# EAGLE design I2C-Codeline-Matrix (EAGLE 7.7.0)
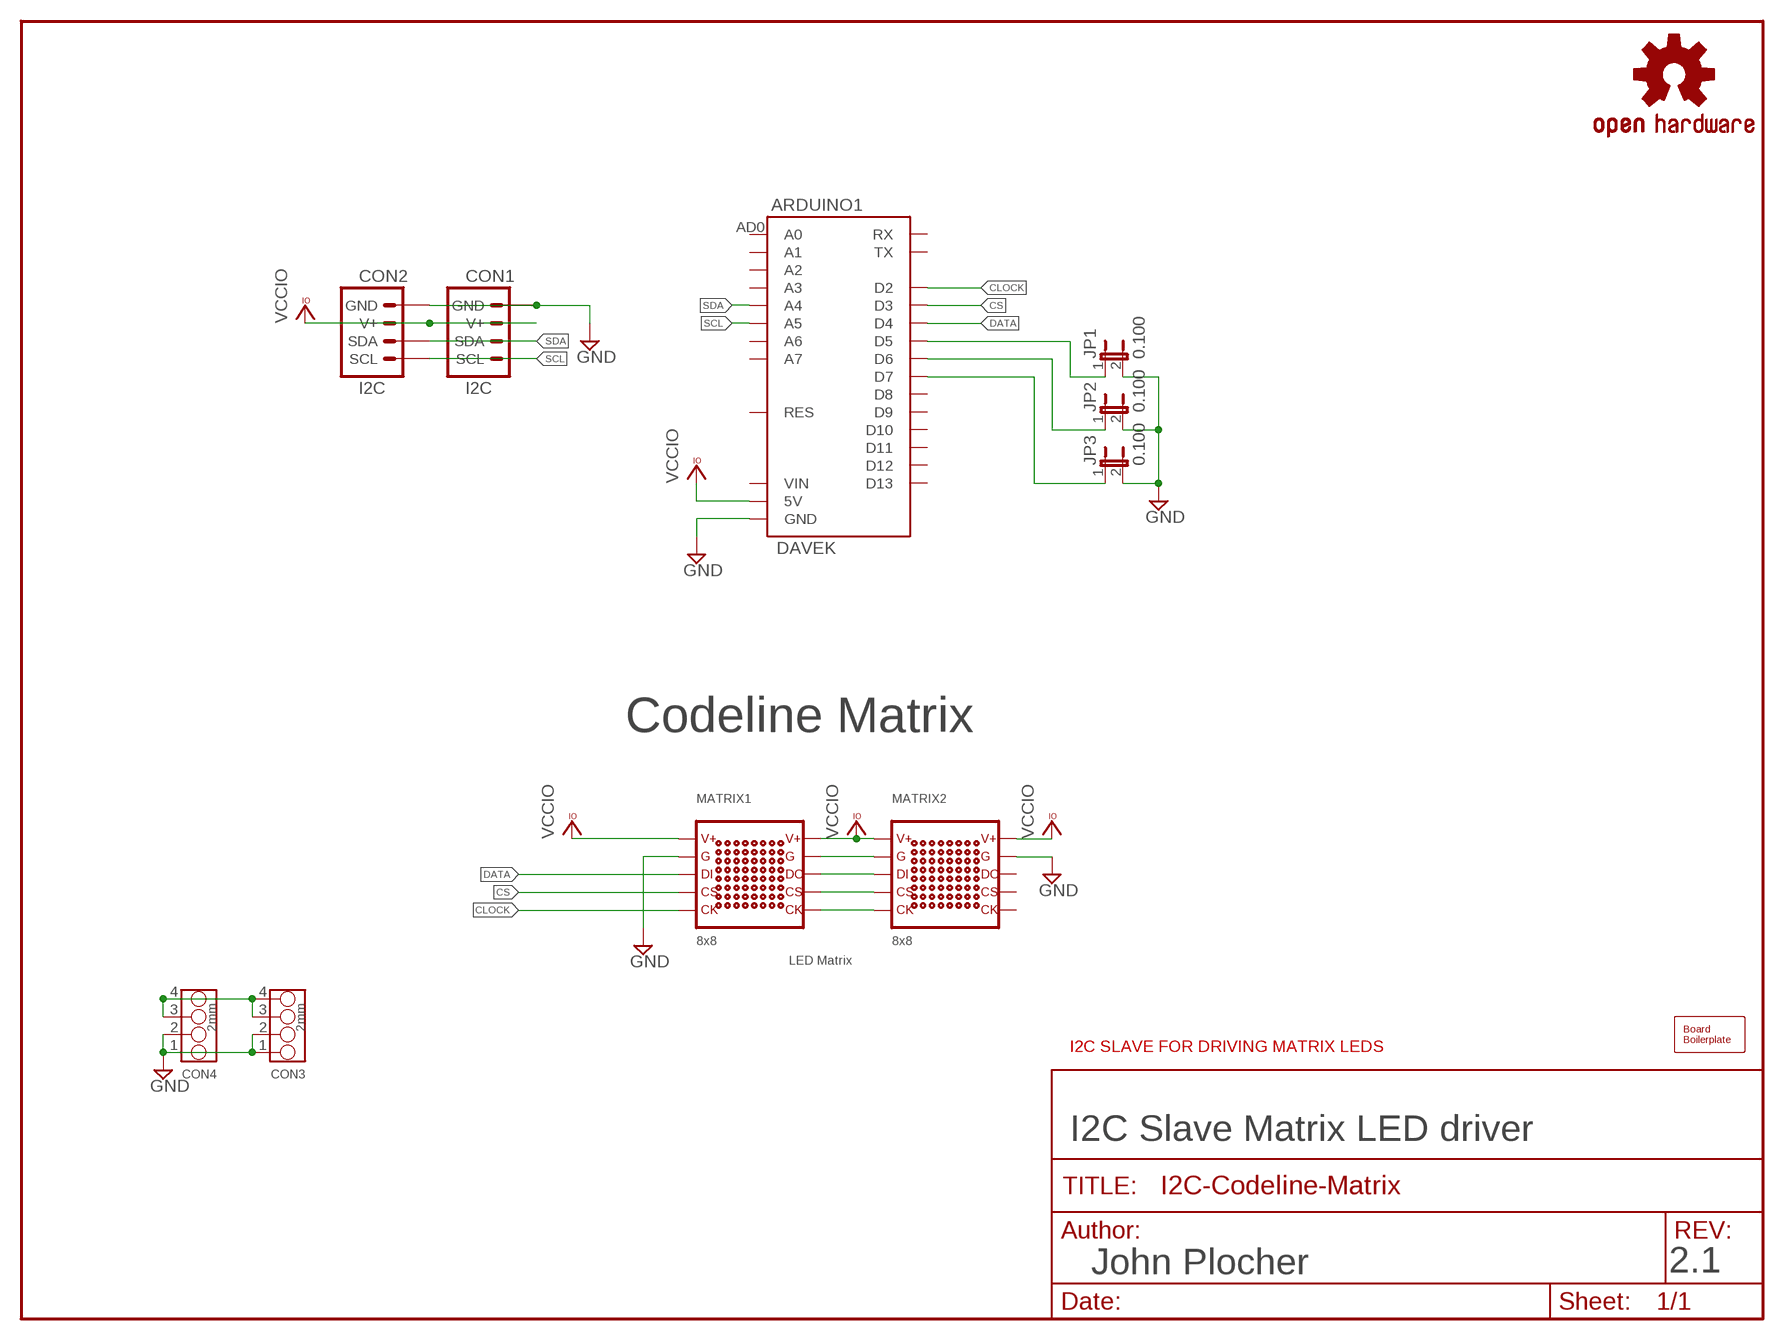
[diagram p0: schematic, sheet 1]

## Parts
ARDUINO1  DAVEK  ARDUINO-PRO-MINIDAVESROBOT  [ARDUINO_PRO_MINI_DAVEK]
BOARD  BOARD  BOARD80X80-NOHOLES  [BOARD-DINRAIL-3.17INX8CM-NOHOLES]
CON1  I2C  CONNECTOR-I2CLEFT  [I2C-L]
CON2  I2C  CONNECTOR-I2CLEFT  [I2C-L]
CON3  2mm  CONNECTOR-GROVE-4P-2.0-3470130P1  [4P-2.0]
CON4  2mm  CONNECTOR-GROVE-4P-2.0-3470130P1  [4P-2.0]
JP1  0.100  JUMPER-2PTH_LOCK  [1X02_LOCK]
JP2  0.100  JUMPER-2PTH_LOCK  [1X02_LOCK]
JP3  0.100  JUMPER-2PTH_LOCK  [1X02_LOCK]
MATRIX1  8x8  LEDMATRIX  [LEDMATRIX]
MATRIX2  8x8  LEDMATRIX  [LEDMATRIX]
OSHW1  OSHW  OSHW-LOGOL  [OSHW-LOGO-L]

## Nets
CLOCK [signals]: ARDUINO1.D2 MATRIX1.CLK@1(CLK)
CS [signals]: ARDUINO1.D3 MATRIX1.CS@1(CS)
DATA [signals]: ARDUINO1.D4 MATRIX1.DI(DIN)
GND [signals]: ARDUINO1.GND@1(GND) ARDUINO1.GND@2(GND) ARDUINO1.GND@4(GND) CON1.GND CON1.GND@1(GND) CON2.GND CON2.GND@1(GND) CON3.1 CON3.2 CON4.1 CON4.2 JP1.2 JP2.2 JP3.2 MATRIX1.G@1(G) MATRIX1.G@2(G) MATRIX2.G@1(G) MATRIX2.G@2(G)
N$1 [Power]: CON3.3 CON3.4 CON4.3 CON4.4
N$3: MATRIX1.DO(DOUT) MATRIX2.DI(DIN)
N$6: ARDUINO1.D5 JP1.1
N$7: ARDUINO1.D6 JP2.1
N$8: ARDUINO1.D7 JP3.1
N$9: MATRIX1.CS@2(CS) MATRIX2.CS@1(CS)
N$10: MATRIX1.CLK@2(CLK) MATRIX2.CLK@1(CLK)
SCL: ARDUINO1.AD5(A5) CON1.SCL CON1.SCL@1(SCL) CON2.SCL CON2.SCL@1(SCL)
SDA: ARDUINO1.AD4(A4) CON1.SDA CON1.SDA@1(SDA) CON2.SDA CON2.SDA@1(SDA)
VCCIO [Power]: ARDUINO1.5V CON1.V+ CON1.V+@1(V+) CON2.V+ CON2.V+@1(V+) MATRIX1.V+@1(V+) MATRIX1.V+@2(V+) MATRIX2.V+@1(V+) MATRIX2.V+@2(V+)
Unconnected: ARDUINO1.AD0(A0) ARDUINO1.AD1(A1) ARDUINO1.AD2(A2) ARDUINO1.AD3(A3) ARDUINO1.AD6(A6) ARDUINO1.AD7(A7) ARDUINO1.D8 ARDUINO1.D9 ARDUINO1.D10 ARDUINO1.D11 ARDUINO1.D12 ARDUINO1.D13 ARDUINO1.RES ARDUINO1.RES@1(RES) ARDUINO1.RX ARDUINO1.TX@1(TX) ARDUINO1.VIN MATRIX2.CLK@2(CLK) MATRIX2.CS@2(CS) MATRIX2.DO(DOUT)

## Notes on the sheet
- Codeline Matrix
- LED Matrix
- I2C SLAVE FOR DRIVING MATRIX LEDS
- I2C Slave Matrix LED driver
- John Plocher | 2.1

## Library data of the parts
ARDUINO1 = SPCoast:ARDUINO-PRO-MINI
BOARD = SPCoast:BOARD
CON1 CON2 = SPCoast:CONNECTOR-I2C
CON3 CON4 = SPCoast:CONNECTOR-GROVE-4P-2.0
JP1-JP3 = SPCoast:JUMPER-2: Jumper Basic 0.1" spaced jumper. Use with breakaway headers.
MATRIX1 MATRIX2 = SPCoast:LEDMATRIX: MAX7219 dot matrix module http://www.ebay.com/itm/10pcs-MAX7219-dot-matrix-module-Arduino-microcontroller-module-DIY-KIT-M67-/351218529526
OSHW1 = SparkFun:OSHW-LOGO: Open Source Hardware Logo This logo indicates the piece of hardware it is found on incorporates a OSHW license and/or adheres to the definition of open source hardware found here: http://freedomdefined.org/OSHW

## Net classes
0 default: width 0.203 mm, drill 0.5 mm, clearance 0.203 mm
1 Power: width 0.406 mm, drill 0.8 mm, clearance 0.254 mm
2 signals: width 0.254 mm, drill 0.6 mm, clearance 0.254 mm
3 Feed: width 1.016 mm, drill 1.4 mm, clearance 0.254 mm

## Board
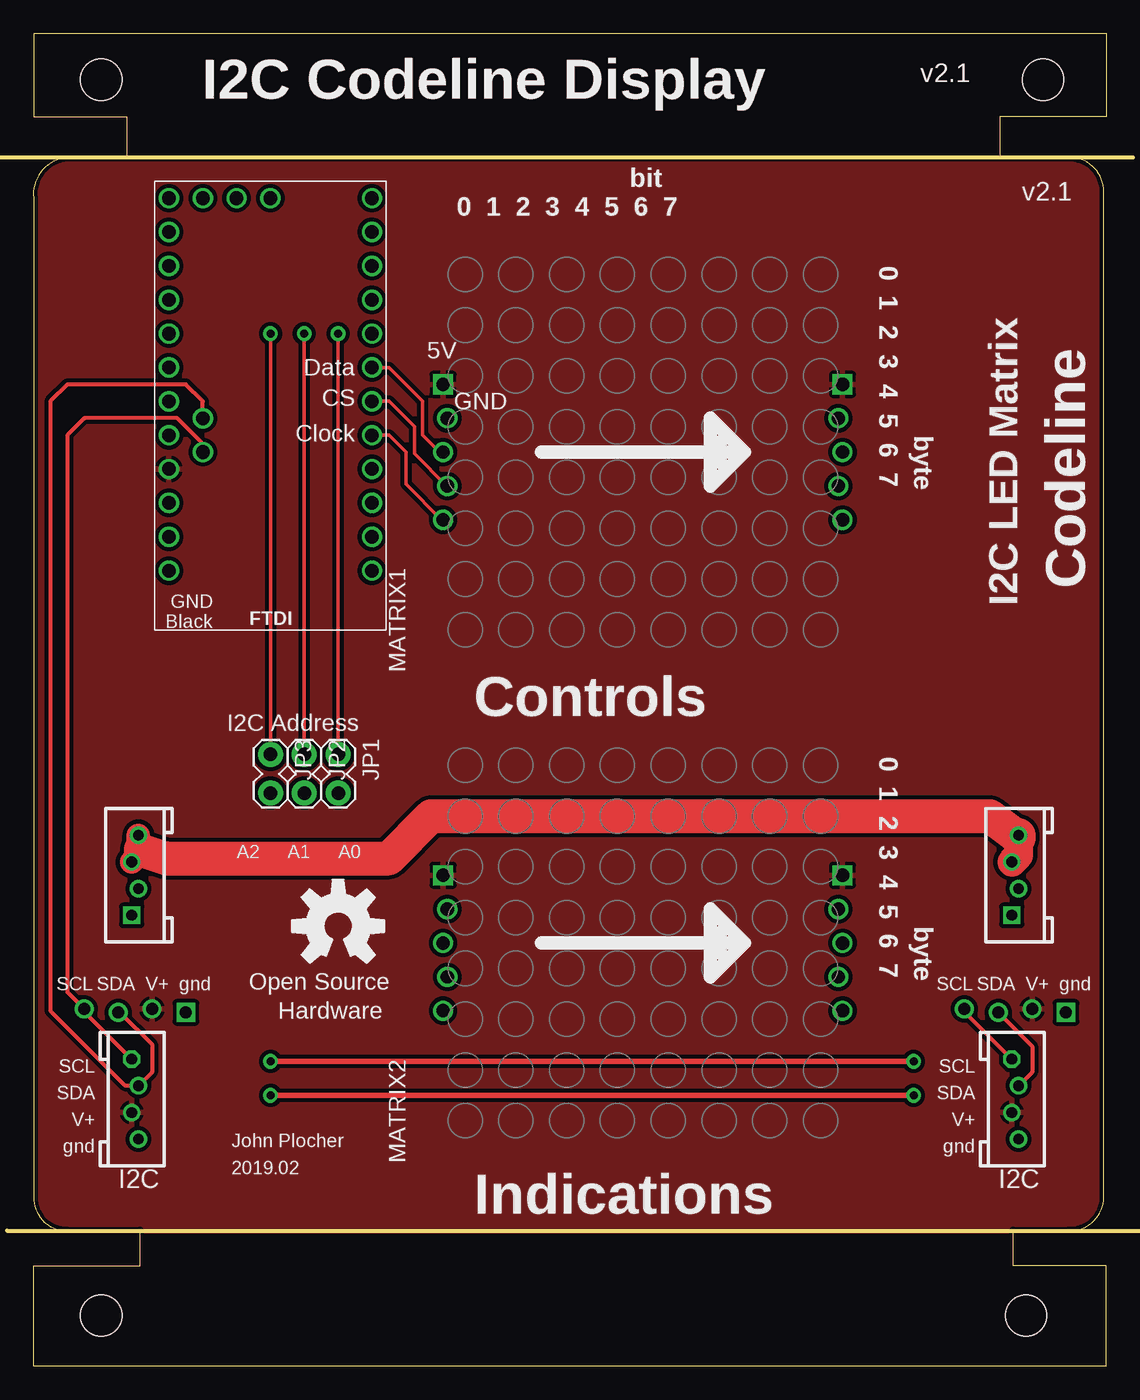
[diagram p1: board, top side]
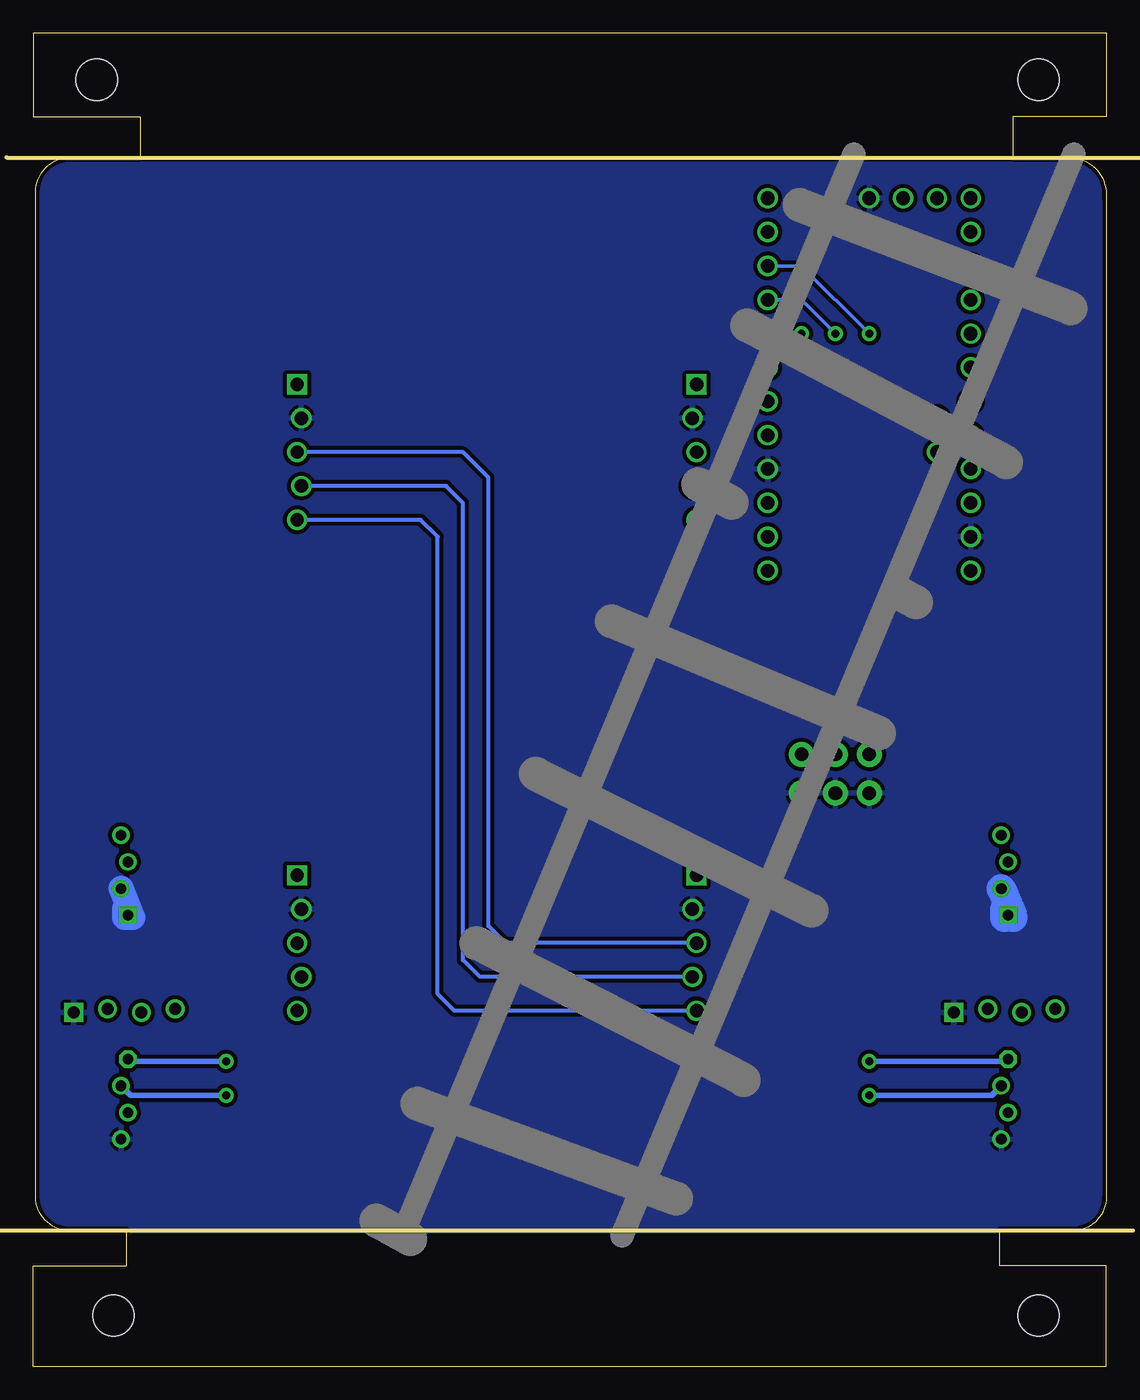
[diagram p2: board, bottom side, seen from below]

Size 80.51 x 100 mm. Coordinates in mm from the lower left corner, seen from the top.
Copper layers (1*16): Top 0.035mm / dielectric 1.5mm / Bottom 0.035mm
Design rules "Fusion_eagle_rule_v1.1 *": minimum track width 8mil, minimum drill 0.6mm, track to track 6mil, track to pad 6mil, pad to pad 10mil, via to via 10mil, smd to smd 10mil, copper to edge 10mil, drill to drill 10mil, minimum pad ring 10mil, minimum via ring 10mil, stop-mask expansion 2mil, vias tented up to drill 100mil, thermal gap 10mil

### Footprints (pad centres in the part's own frame; a part is rotated, then mirrored left to right if it is on the bottom)
ARDUINO_PRO_MINI_DAVEK = drill 1.016: 5V 16.51,21.59; AD0 16.51,11.43; AD1 16.51,13.97; AD2 16.51,16.51; AD3 16.51,19.05; AD4 13.97,17.78; AD5 13.97,20.32; AD6 11.43,1.27; AD7 13.97,1.27; D2 1.27,19.05; D3 1.27,16.51; D4 1.27,13.97; D5 1.27,11.43; D6 1.27,8.89; D7 1.27,6.35; D8 1.27,3.81; D9 1.27,1.27; D10 16.51,1.27; D11 16.51,3.81; D12 16.51,6.35; D13 16.51,8.89; GND@1 16.51,26.67; GND@2 8.89,1.27; GND@4 1.27,21.59; RES 16.51,24.13; RES@1 1.27,24.13; RX 1.27,26.67; TX@1 1.27,29.21; VIN 16.51,29.21
BOARD-DINRAIL-3.17INX8CM-NOHOLES = hole 3.1: 5.08,96.52; 75.75,96.52; 5.08,3.81; 74.48,3.81
I2C-L = drill 0.9 square: GND 3.81,-0.127 | drill 0.8 pad 1.27: GND@1 0.254,-9.635; SDA@1 0.254,-5.635; V+@1 -0.254,-7.635 | drill 0.9: SCL -3.81,0.127; SDA -1.27,-0.127; V+ 1.27,0.127 | drill 0.8 pad 1.27 octagon: SCL@1 -0.254,-3.635
4P-2.0 = drill 0.8 pad 1.27 square: 1 -3,0.254 | drill 0.8 pad 1.27: 2 -1,-0.254; 3 1,0.254; 4 3,-0.254
1X02_LOCK = drill 1.016 pad 1.88: 1 -0.178,0; 2 2.718,0
LEDMATRIX = drill 1: CLK@1 -14.986,-5.08; CLK@2 14.986,-5.08; CS@1 -14.668,-2.54; CS@2 14.668,-2.54; DI -14.986,0; DO 14.986,0; G@1 -14.668,2.54; G@2 14.668,2.54 | drill 1 square: V+@1 -14.986,5.08; V+@2 14.986,5.08

### Placement (x,y rotation side)
ARDUINO1  26.68,88.9 180 top
BOARD  0.01,0 0 top
CON1  73.67,26.67 0 top
CON2  7.63,26.67 0 top
CON3  7.63,36.83 90 top
CON4  73.67,36.83 90 top
JP1  22.87,45.72 270 top
JP2  20.33,45.72 270 top
JP3  17.79,45.72 270 top
MATRIX1  45.73,68.58 0 top
MATRIX2  45.73,31.75 0 top
OSHW1  22.87,33.02 0 top

### Tracks (layer width: path | path; a pad name or v marks a point on that pad's centre or on a via)
CLOCK
  Top 0.254: ARDUINO1.D2 26.68,69.85 27.95,68.58 27.95,66.17 30.62,63.5 MATRIX1.CLK@1
CS
  Top 0.254: ARDUINO1.D3 26.68,72.39 28.59,70.48 28.59,68.45 31,66.04 MATRIX1.CS@1
DATA
  Top 0.254: ARDUINO1.D4 26.68,74.93 29.22,72.39 29.22,69.85 30.49,68.58 MATRIX1.DI
GND
  Bottom 1.93: CON4.2 73.04,33.66 73.67,33.66 73.67,34.29
  Bottom 2.184: CON3.2 7,33.66 7.63,33.66 7.63,34.29
  pour Bottom (isolate 0.305, rank 2): 80.02,10.16 80.02,90.17 0.01,90.17 0.01,10.16
N$1
  Top 1.778: CON3.4 7.89,38.34 CON3.3 8.06,38.73
  Top 2.184: CON4.3 73.93,38.34 CON4.4
  Top 2.54: 8.06,38.73 9.97,38.1 26.68,38.1 29.86,41.27 71.77,41.27 73.93,39.62 CON4.4
N$3
  Bottom 0.305: MATRIX2.DI 45.1,31.75 46.37,33.02 46.37,66.67 48.27,68.58 MATRIX1.DO
N$6  (via drill 0.6)
  Top 0.254: v22.87,77.47 JP1.1
  Bottom 0.254: ARDUINO1.D5 v22.87,77.47
N$7  (via drill 0.6)
  Top 0.254: v20.33,77.47 JP2.1
  Bottom 0.254: v20.33,77.47 22.87,80.01 ARDUINO1.D6
N$8  (via drill 0.6)
  Top 0.254: v17.79,77.47 JP3.1
  Bottom 0.254: v17.79,77.47 22.87,82.55 ARDUINO1.D7
N$9
  Bottom 0.305: MATRIX2.CS@1 47,29.21 48.27,30.48 48.27,64.77 49.54,66.04 MATRIX1.CS@2
N$10
  Bottom 0.305: MATRIX2.CLK@1 48.91,26.67 50.18,27.94 50.18,62.23 51.45,63.5 MATRIX1.CLK@2
SCL  (via drill 0.6)
  Top 0.305: CON2.SCL@1 3.82,26.59 CON2.SCL 2.55,28.07 2.55,69.85 3.82,71.12 10.81,71.12 12.71,69.22 ARDUINO1.AD5 | CON1.SCL 69.86,26.59 CON1.SCL@1
  Top 0.406: v17.79,22.86 v66.05,22.86
  Bottom 0.406: CON2.SCL@1 7.55,22.86 v17.79,22.86 | v66.05,22.86 73.24,22.86 arc90 CON1.SCL@1
SDA  (via drill 0.6)
  Top 0.305: CON2.SDA 6.49,26.54 8.9,24.13 8.9,22.05 CON2.SDA@1 7.84,21.08 6.87,21.08 1.28,26.67 1.28,72.39 2.55,73.66 11.44,73.66 12.71,72.39 ARDUINO1.AD4 | CON1.SDA 74.94,24 74.94,22.05 CON1.SDA@1
  Top 0.406: CON1.SDA@1 73.85,20.95 | v17.79,20.32 v66.05,20.32
  Bottom 0.406: CON2.SDA@1 8.6,20.32 v17.79,20.32 | v66.05,20.32 73.21,20.32 CON1.SDA@1
VCCIO
  pour Top (isolate 0.305, rank 2): 80.02,10.16 80.02,90.17 0.01,90.17 0.01,10.16

### Text on the board
tPlace: v2.1 | I2C Codeline Display | bit | v2.1 | 0 1 2 3 4 5 6 7 | 0 1 2 3 4 5 6 7 | 5V | Data | CS | GND | Clock | byte | Codeline | I2C LED Matrix | Controls | I2C Address | 0 1 2 3 4 5 6 7 | A2 | A1 | A0 | byte | Open Source | Hardware | John Plocher | 2019.02 | Indications
bDocu: Codeline Display | I2C LED Matrix | Go Bears! | Model Railroading is fun! | Made in the PCR, Coast Division, NMRA | www. SP Coast .com